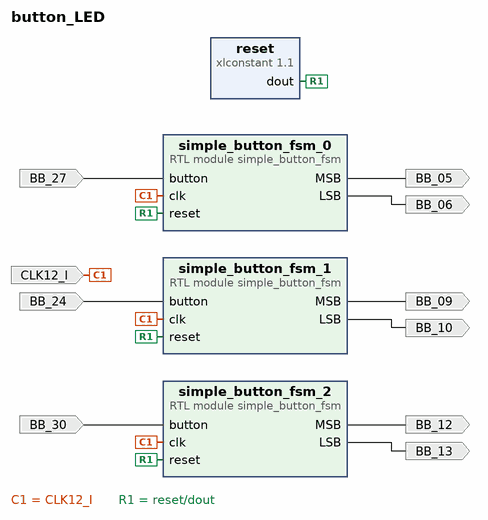
[diagram p0: block diagram of the top level]
# Vivado block design button_LED, xc7s15ftgb196-1, Vivado 2025.2
create_bd_design button_LED

create_bd_port -dir I -type clk CLK12_I
create_bd_port -dir I BB_24
create_bd_port -dir I BB_30
create_bd_port -dir I BB_27
create_bd_port -dir O BB_12
create_bd_port -dir O BB_06
create_bd_port -dir O BB_05
create_bd_port -dir O BB_10
create_bd_port -dir O BB_09
create_bd_port -dir O BB_13

create_bd_cell -type ip -vlnv xilinx.com:ip:xlconstant:1.1 reset
set_property -dict {CONFIG.CONST_VAL 0} [get_bd_cells reset]
create_bd_cell -type module -reference simple_button_fsm simple_button_fsm_0
create_bd_cell -type module -reference simple_button_fsm simple_button_fsm_1
create_bd_cell -type module -reference simple_button_fsm simple_button_fsm_2

# ---- connections ----

connect_bd_net -net BB_24_1 [get_bd_ports BB_24] [get_bd_pins simple_button_fsm_1/button]
connect_bd_net -net BB_27_1 [get_bd_ports BB_27] [get_bd_pins simple_button_fsm_0/button]
connect_bd_net -net BB_30_1 [get_bd_ports BB_30] [get_bd_pins simple_button_fsm_2/button]
connect_bd_net [get_bd_ports CLK12_I] \
  [get_bd_pins simple_button_fsm_0/clk] [get_bd_pins simple_button_fsm_1/clk] [get_bd_pins simple_button_fsm_2/clk]
connect_bd_net [get_bd_pins reset/dout] \
  [get_bd_pins simple_button_fsm_0/reset] [get_bd_pins simple_button_fsm_1/reset] [get_bd_pins simple_button_fsm_2/reset]
connect_bd_net [get_bd_pins simple_button_fsm_0/LSB] [get_bd_ports BB_06]
connect_bd_net [get_bd_pins simple_button_fsm_0/MSB] [get_bd_ports BB_05]
connect_bd_net [get_bd_pins simple_button_fsm_1/LSB] [get_bd_ports BB_10]
connect_bd_net [get_bd_pins simple_button_fsm_1/MSB] [get_bd_ports BB_09]
connect_bd_net [get_bd_pins simple_button_fsm_2/LSB] [get_bd_ports BB_13]
connect_bd_net [get_bd_pins simple_button_fsm_2/MSB] [get_bd_ports BB_12]

validate_bd_design
save_bd_design
